# Altium schematic sheet DC_link_input_bckp.SchDoc
size A4
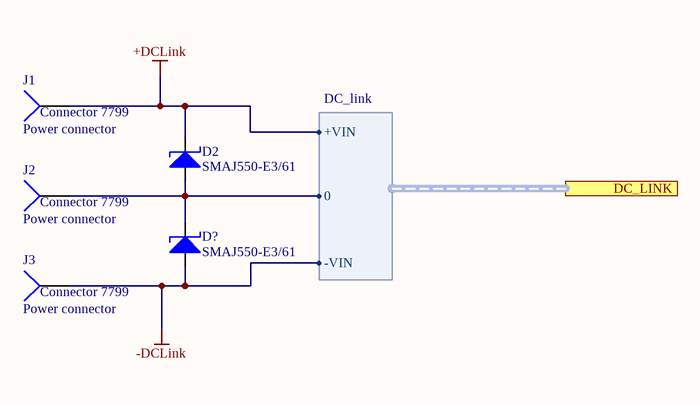
[diagram p0: DC_link_input_bckp.SchDoc]

## Parts
D2  SMAJ550-E3/61  [DO 214]
D?  SMAJ550-E3/61  [DO 214]
J1  Power connector  value Connector 7799  [7799 Power Connector]
J2  Power connector  value Connector 7799  [7799 Power Connector]
J3  Power connector  value Connector 7799  [7799 Power Connector]

## Ports
DC_LINK (harness DC_link)

## Harnesses
DC_link: +VIN, -VIN, 0

## Nets
+DCLink: D2.2 J1.1
-DCLink: D?.1 J3.1
NetD2_1: D2.1 D?.2 J2.1 ; port DC_LINK.0

## Notes on the sheet
- Title
- Size:
- Date:
- A4
- Number:
- Time:
- Revision:
- Sheet
- of
- Author
- Organization
- File:

## Library data of the parts
D2 D? = SMAJ550-E3/61: TVS DIODE 495V 760V DO214AC; PN: SMAJ550-E3/61; Value: SMAJ550-E3/61
J1-J3 = Power connector: TERM SCREW M4 6 PIN PCB; PN: 36-7799-ND; ClassName: direct_plane_connect